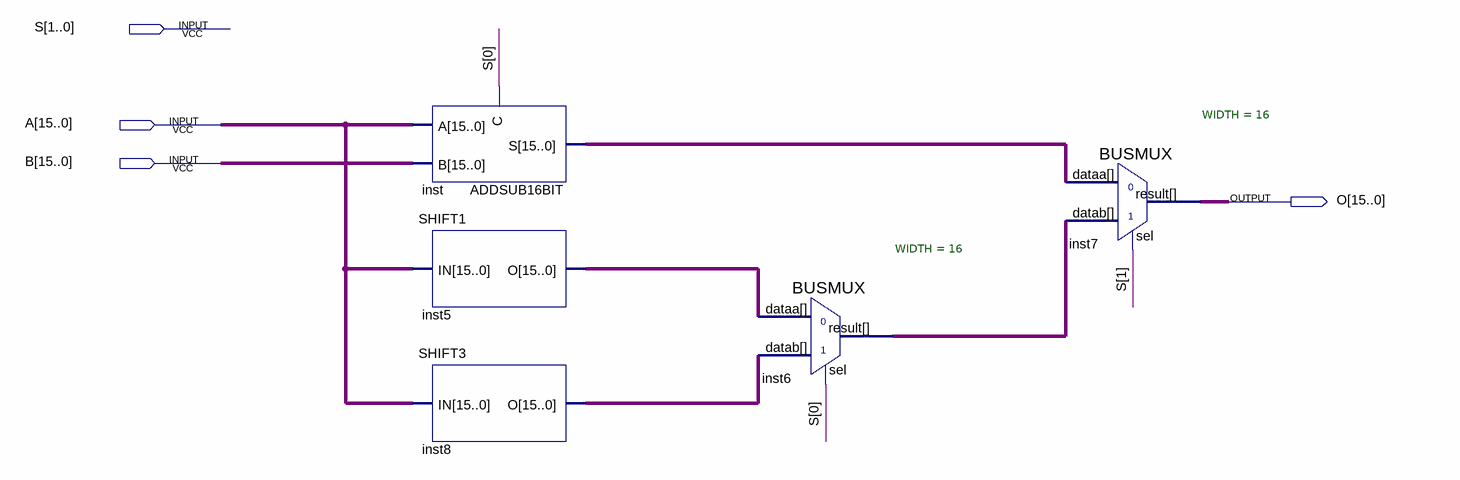
[diagram p0: schematic sheet]
// Quartus schematic ALU.bdf as structural Verilog: 5 symbols, 4 pins
module ALU (
  input  [1:0] S,
  input  [15:0] A,
  input  [15:0] B,
  output [15:0] O
);

  wire [15:0] inst5_o, inst6_result, inst8_o, inst_s;

  ADDSUB16BIT inst (.C(S[0]), .A(A), .B(B), .S(inst_s));
  SHIFT1 inst5 (.IN(A), .O(inst5_o));
  SHIFT3 inst8 (.IN(A), .O(inst8_o));
  BUSMUX #(.WIDTH(16)) inst6 (.datab(inst8_o), .sel(S[0]), .dataa(inst5_o), .result(inst6_result));
  BUSMUX #(.WIDTH(16)) inst7 (.datab(inst6_result), .sel(S[1]), .dataa(inst_s), .result(O));
endmodule
